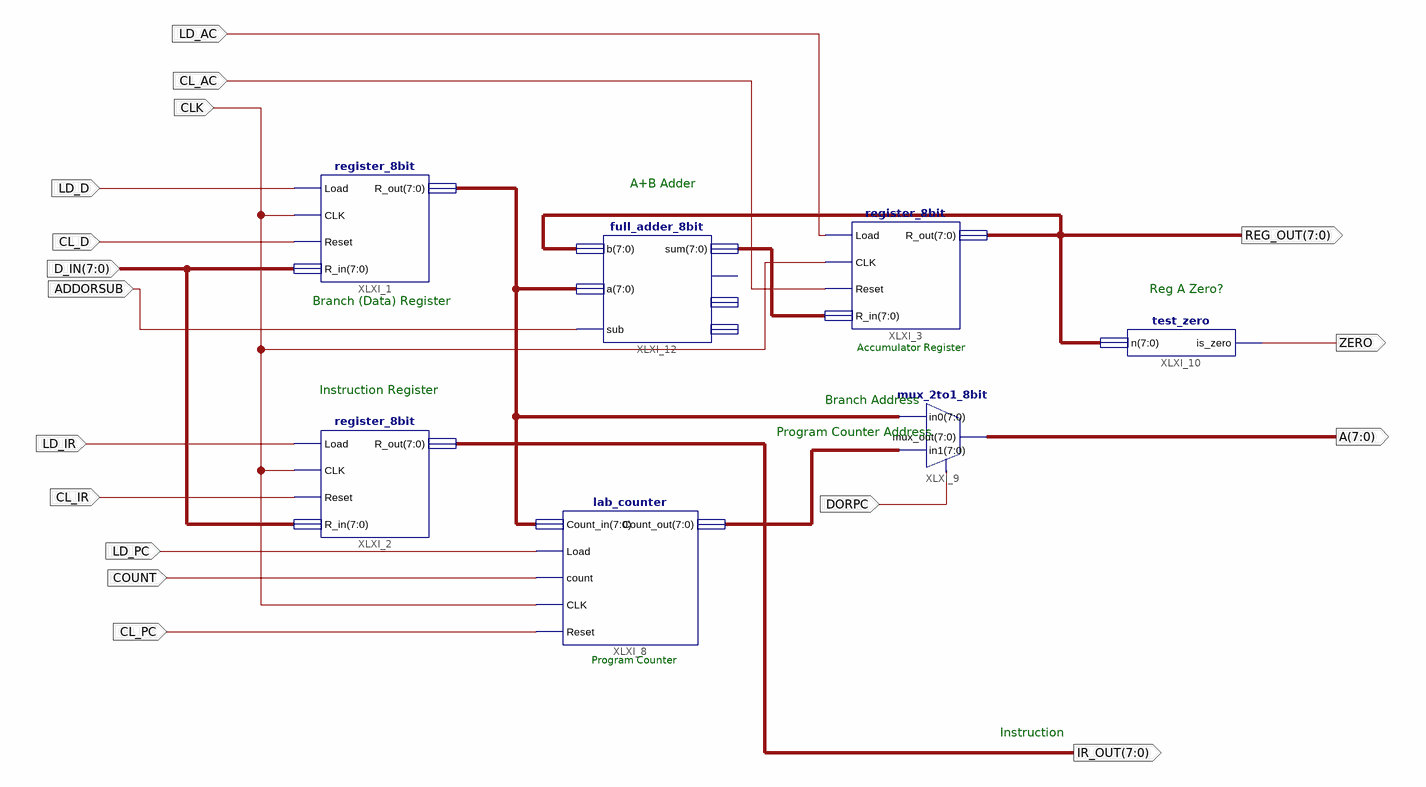
[diagram p0: schematic sheet 1]
// Xilinx ISE schematic datapath_lab.sch (spartan3e) as structural Verilog: 7 symbols, 17 ports
module datapath_lab (
  input  LD_IR,
  input  CL_IR,
  input  [7:0] D_IN,
  input  CLK,
  input  LD_D,
  input  CL_D,
  input  LD_PC,
  input  COUNT,
  input  CL_PC,
  input  LD_AC,
  input  CL_AC,
  input  DORPC,
  input  ADDORSUB,
  output [7:0] REG_OUT,
  output ZERO,
  output [7:0] IR_OUT,
  output [7:0] A
);

  wire [7:0] XLXN_1, XLXN_22, XLXN_25;

  register_8bit XLXI_1 (.Load(LD_D), .CLK(CLK), .Reset(CL_D), .R_in(D_IN), .R_out(XLXN_22));
  register_8bit XLXI_2 (.Load(LD_IR), .CLK(CLK), .Reset(CL_IR), .R_in(D_IN), .R_out(IR_OUT));
  register_8bit XLXI_3 (.Load(LD_AC), .CLK(CLK), .Reset(CL_AC), .R_in(XLXN_1), .R_out(REG_OUT));
  lab_counter XLXI_8 (.Count_in(XLXN_22), .Load(LD_PC), .count(COUNT), .CLK(CLK), .Reset(CL_PC), .Count_out(XLXN_25));
  mux_2to1_8bit XLXI_9 (.in0(XLXN_22), .sel(DORPC), .mux_out(A), .in1(XLXN_25));
  test_zero XLXI_10 (.n(REG_OUT), .is_zero(ZERO));
  full_adder_8bit XLXI_12 (.b(REG_OUT), .a(XLXN_22), .sub(ADDORSUB), .sum(XLXN_1));  // open: c_out, g, p

  // Notes on the sheet:
  //   A+B Adder
  //   Reg A Zero?
  //   Branch (Data) Register
  //   Accumulator Register
  //   Instruction Register
  //   Branch Address
  //   Program Counter Address
  //   Program Counter
  //   Instruction
endmodule
